# Altium schematic sheet DeadTimeDriver_Leg.SchDoc: Dead time & interlock
size A4; CheckedBy: Hildo / Joel; Author: Fellipe; Organization: UNICAMP / LCEE; Address1: University of Campinas - Brazil; Address2: Power Conditioning Laboratory; Address3: Licensed by GNU GPL 3.0; ProjectName: Easy Inverter
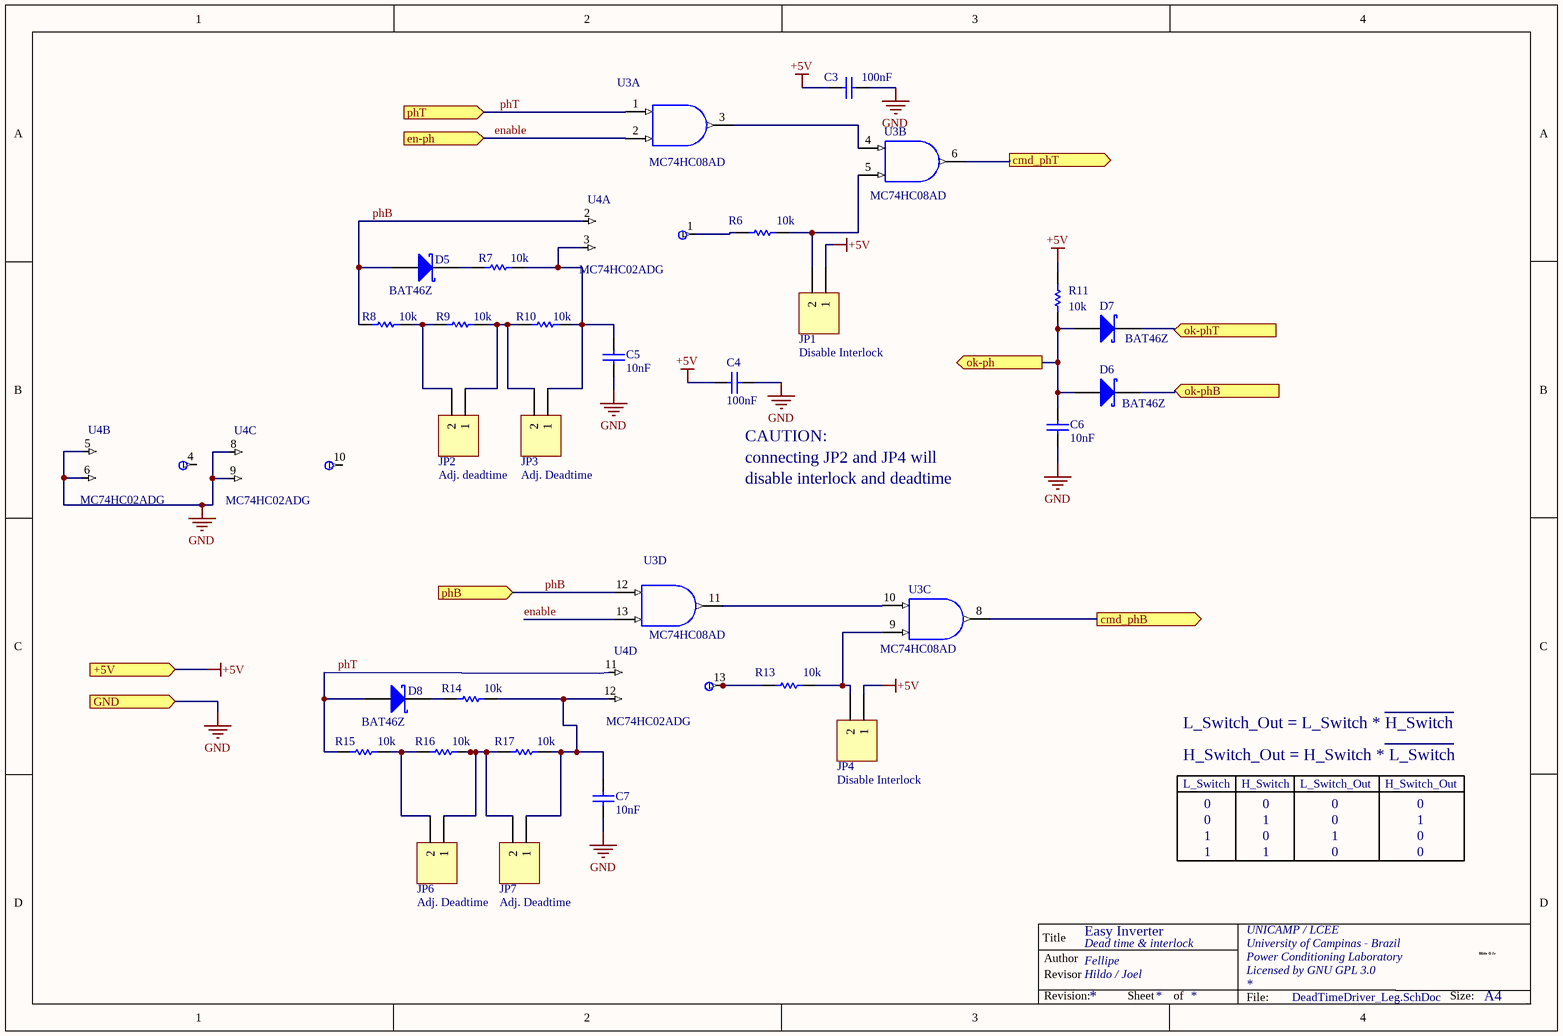
[diagram p0: DeadTimeDriver_Leg.SchDoc]

## Parts
C3  value 100nF  [0805_W]
C4  value 100nF  [0805_W]
C5  value 10nF  [0805_W]
C6  value 10nF  [0805_W]
C7  value 10nF  [0805_W]
D5  value BAT46Z  [SOD-123]
D6  value BAT46Z  [SOD-123]
D7  value BAT46Z  [SOD-123]
D8  value BAT46Z  [SOD-123]
JP1  Disable Interlock  [Jumper]
JP2  Adj. deadtime  [Jumper]
JP3  Adj. Deadtime  [Jumper]
JP4  Disable Interlock  [Jumper]
JP6  Adj. Deadtime  [Jumper]
JP7  Adj. Deadtime  [Jumper]
R6  value 10k  [0805_W]
R7  value 10k  [0805_W]
R8  value 10k  [0805_W]
R9  value 10k  [0805_W]
R10  value 10k  [0805_W]
R11  value 10k  [0805_W]
R13  value 10k  [0805_W]
R14  value 10k  [0805_W]
R15  value 10k  [0805_W]
R16  value 10k  [0805_W]
R17  value 10k  [0805_W]
U3  value MC74HC08AD  [SOIC-14N]  (parts A,B,C,D of 4)
U4  value MC74HC02ADG  [SOIC-14N]  (parts A,B,C,D of 4)

## Ports
+5V (in), cmd_phB (out), cmd_phT (out), en-ph (in), GND (in), ok-ph (out), ok-phB (in), ok-phT (in), phB (in), phT (in)

## Nets
+5V: C3.1 C4.1 JP1.1 JP4.1 R11.2 U3.14(VDD) U4.14(VDD) ; port +5V
GND: C3.2 C4.2 C5.2 C6.2 C7.2 U3.7(GND) U4.5 U4.6 U4.7(GND) U4.8 U4.9 ; port GND
cmd_phB: U3.8(Y) ; port cmd_phB
cmd_phT: U3.6(Y) ; port cmd_phT
enable: U3.2(B) U3.13(B) ; port en-ph
ok-ph: C6.1 D6.1(A) D7.1(A) R11.1 ; port ok-ph
ok-phB: D6.2(K) ; port ok-phB
ok-phT: D7.2(K) ; port ok-phT
phB: D5.1(A) R8.1 U3.12(A) U4.2 ; port phB
phT: D8.1(A) R15.1 U3.1(A) U4.11 ; port phT
NetC5_1: C5.1 JP3.1 R7.2 R10.2 U4.3
NetC7_1: C7.1 JP7.1 R14.2 R17.2 U4.12
NetD5_2: D5.2(K) R7.1
NetD8_2: D8.2(K) R14.1
NetJP1_2: JP1.2 R6.2 U3.5(B)
NetJP2_1: JP2.1 JP3.2 R9.2 R10.1
NetJP2_2: JP2.2 R8.2 R9.1
NetJP4_2: JP4.2 R13.2 U3.9(A)
NetJP6_1: JP6.1 JP7.2 R16.2 R17.1
NetJP6_2: JP6.2 R15.2 R16.1
NetR6_1: R6.1 U4.1
NetR13_1: R13.1 U4.13
NetU3_3: U3.3(Y) U3.4(A)
NetU3_10: U3.10(B) U3.11(Y)

Not connected (* = marked no-connect by the designer): U4 4 10

## Notes on the sheet
- (near C4) CAUTION:
- connecting JP2 and JP4 will
- disable interlock and deadtime
- L_Switch
- L_Switch_Out = L_Switch * H_Switch
- H_Switch_Out = H_Switch * L_Switch
- H_Switch
- L_Switch_Out
- H_Switch_Out
- 0
- 1
- Title
- Author
- Revisor
- Hildo G Jr
- Revision:
- Sheet
- of
- File:
- Size:
- A4
- HGJr

## Library data of the parts
C3 C4 = Capacitor_nao_polarizado: Capacitor nao polarizado; pn: 08053C104KAT2A
C5-C7 = Cap_0805: Capacitor; Published: 8-Jun-2000; LatestRevisionDate: 17-Jul-2002; LatestRevisionNote: Re-released for DXP Platform.; PackageReference: RAD-0.3; Publisher: Altium Limited; Value: Value
D5-D8 = D Schottky: Schottky Diode; pn: BAT46ZFILM
JP1-JP4 JP6 JP7 = Header 2: Header, 2-Pin; Value: solder jumper
R6-R11 R13-R17 = Res_0805: Resistor; Manufacturer: Generic Components; Class: Passive; Published: 08/06/2000; Publisher: Altium Hobart Technology Centre; SubClass: Resistor; Value: Value
U3 = MC74HC08AD: Quad 2-Input AND Gate; pn: MC74HC08ADG
U4 = Double 2-input NOR: SN74AUP2G02DCUR; pn: MC74HC02ADG